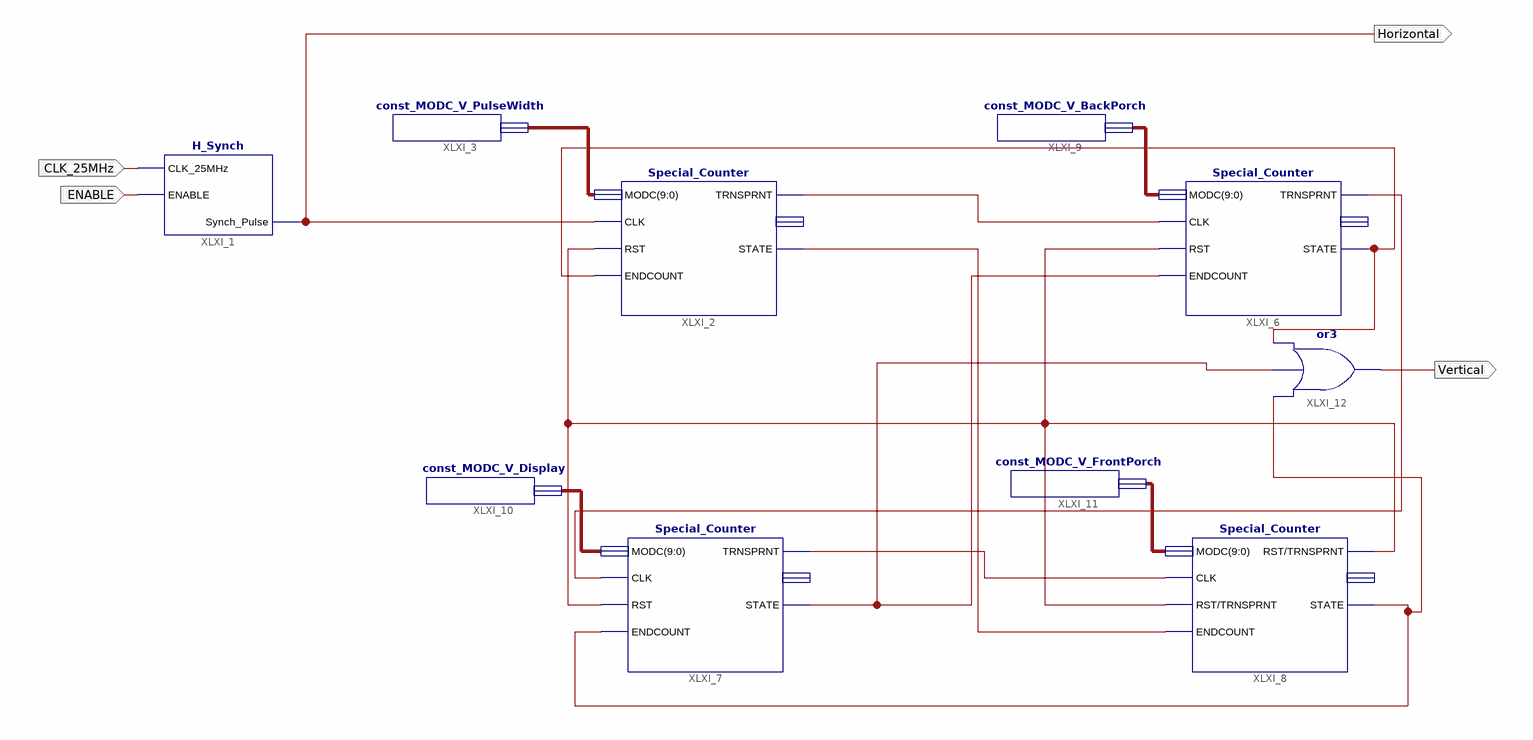
[diagram p0: schematic sheet 1]
// Xilinx ISE schematic V_Synch.sch (spartan6) as structural Verilog: 10 symbols, 4 ports
module V_Synch (
  input  CLK_25MHz,
  input  ENABLE,
  output Horizontal,
  output Vertical
);

  wire XLXN_6, XLXN_7, XLXN_8, XLXN_9, XLXN_10, XLXN_14, XLXN_21, XLXN_24;
  wire [9:0] XLXN_3, XLXN_18, XLXN_19, XLXN_20;

  H_Synch XLXI_1 (.CLK_25MHz(CLK_25MHz), .ENABLE(ENABLE), .Synch_Pulse(Horizontal));
  Special_Counter XLXI_2 (
    .CLK(Horizontal), .RST(XLXN_14), .ENDCOUNT(XLXN_21), .MODC(XLXN_3), .STATE(XLXN_9), .TRNSPRNT(XLXN_6));  // open: Q
  const_MODC_V_PulseWidth XLXI_3 (.MODC(XLXN_3));
  Special_Counter XLXI_6 (
    .CLK(XLXN_6), .RST(XLXN_14), .ENDCOUNT(XLXN_24), .MODC(XLXN_18), .STATE(XLXN_21), .TRNSPRNT(XLXN_7));  // open: Q
  Special_Counter XLXI_7 (
    .CLK(XLXN_7), .RST(XLXN_14), .ENDCOUNT(XLXN_10), .MODC(XLXN_19), .STATE(XLXN_24), .TRNSPRNT(XLXN_8));  // open: Q
  Special_Counter XLXI_8 (
    .CLK(XLXN_8), .RST(XLXN_14), .ENDCOUNT(XLXN_9), .MODC(XLXN_20), .STATE(XLXN_10), .TRNSPRNT(XLXN_14));  // open: Q
  const_MODC_V_BackPorch XLXI_9 (.MODC(XLXN_18));
  const_MODC_V_Display XLXI_10 (.MODC(XLXN_19));
  const_MODC_V_FrontPorch XLXI_11 (.MODC(XLXN_20));
  or XLXI_12 (Vertical, XLXN_10, XLXN_24, XLXN_21);
endmodule
